# EAGLE design R-breakout (EAGLE 6.6.0)
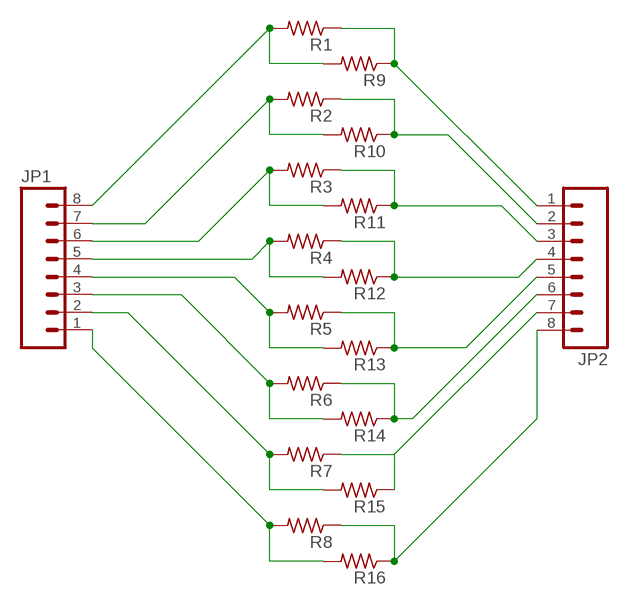
[diagram p0: schematic, sheet 1]

## Parts
JP1  M081X08  [1X08]
JP2  M081X08  [1X08]
R1  RESISTORR0805  [R0805]
R2  RESISTORR0805  [R0805]
R3  RESISTORR0805  [R0805]
R4  RESISTORR0805  [R0805]
R5  RESISTORR0805  [R0805]
R6  RESISTORR0805  [R0805]
R7  RESISTORR0805  [R0805]
R8  RESISTORR0805  [R0805]
R9  RESISTORR1206  [R1206]
R10  RESISTORR1206  [R1206]
R11  RESISTORR1206  [R1206]
R12  RESISTORR1206  [R1206]
R13  RESISTORR1206  [R1206]
R14  RESISTORR1206  [R1206]
R15  RESISTORR1206  [R1206]
R16  RESISTORR1206  [R1206]

## Nets
N$1: JP1.8 R1.2 R9.2
N$2: JP1.7 R2.2 R10.2
N$3: JP1.6 R3.2 R11.2
N$4: JP1.5 R4.2 R12.2
N$5: JP1.4 R5.2 R13.2
N$6: JP1.3 R6.2 R14.2
N$7: JP1.2 R7.2 R15.2
N$8: JP1.1 R8.2 R16.2
N$9: JP2.1 R1.1 R9.1
N$10: JP2.2 R2.1 R10.1
N$11: JP2.3 R3.1 R11.1
N$12: JP2.4 R4.1 R12.1
N$13: JP2.5 R5.1 R13.1
N$14: JP2.6 R6.1 R14.1
N$15: JP2.7 R7.1 R15.1
N$16: JP2.8 R8.1 R16.1

## Library data of the parts
JP1 JP2 = iStivi - Header-Connector:M08: Header 8 Standard 8-pin 0.1" header. Use with straight break away headers (SKU : PRT-00116), right angle break away headers (PRT-00553), swiss pins (PRT-00743), machine pins (PRT-00117), and female headers (PRT-00115).
R1-R16 = iStivi - RCLD:RESISTOR: RESISTOR

## Board
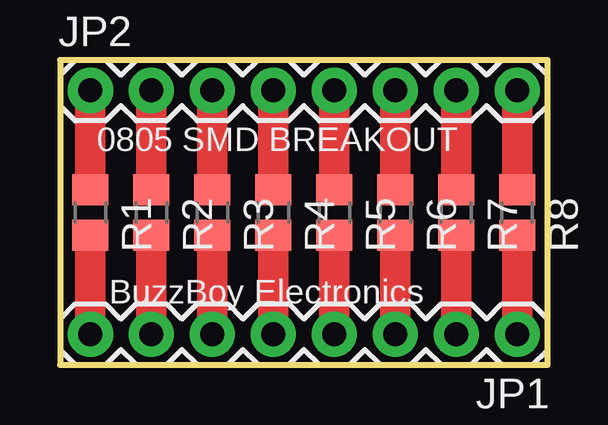
[diagram p1: board, top side]
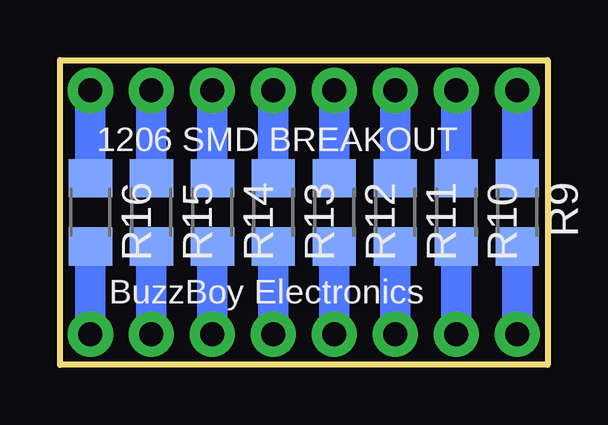
[diagram p2: board, bottom side, seen from below]

Size 20.32 x 12.7 mm. Coordinates in mm from the lower left corner, seen from the top.
Outline: 0,0 20.32,0 20.32,12.7 0,12.7 0,0
Copper layers (1*16): Top 0.035mm / dielectric 1.5mm / Bottom 0.035mm
Design rules "default": minimum track width 10mil, minimum drill 0.6mm, track to track 8mil, track to pad 8mil, pad to pad 8mil, via to via 8mil, smd to smd 8mil, copper to edge 40mil, drill to drill 8mil, minimum pad ring 10mil, minimum via ring 8mil, stop-mask expansion 4mil, vias tented up to drill 0mil, thermal gap 10mil

### Footprints (pad centres in the part's own frame; a part is rotated, then mirrored left to right if it is on the bottom)
1X08 = drill 1 pad 1.88: 1 0,0; 2 2.54,0; 3 5.08,0; 4 7.62,0; 5 10.16,0; 6 12.7,0; 7 15.24,0; 8 17.78,0
R0805 = smd 1.3 x 1.5: 1 -0.95,0; 2 0.95,0
R1206 = smd 1.6 x 1.803: 1 -1.422,0; 2 1.422,0

### Placement (x,y rotation side)
JP1  19.05,1.27 180 top
JP2  1.27,11.43 0 top
R1  1.27,6.35 270 top
R2  3.81,6.35 270 top
R3  6.35,6.35 270 top
R4  8.89,6.35 270 top
R5  11.43,6.35 270 top
R6  13.97,6.35 270 top
R7  16.51,6.35 270 top
R8  19.05,6.35 270 top
R9  1.27,6.35 270 bottom
R10  3.81,6.35 270 bottom
R11  6.35,6.35 270 bottom
R12  8.89,6.35 270 bottom
R13  11.43,6.35 270 bottom
R14  13.97,6.35 270 bottom
R15  16.51,6.35 270 bottom
R16  19.05,6.35 270 bottom

### Tracks (layer width: path | path; a pad name or v marks a point on that pad's centre or on a via)
N$1
  Top 1.27: R1.2 JP1.8
  Bottom 1.27: R9.2 JP1.8
N$2
  Top 1.27: R2.2 JP1.7
  Bottom 1.27: R10.2 JP1.7
N$3
  Top 1.27: R3.2 JP1.6
  Bottom 1.27: R11.2 JP1.6
N$4
  Top 1.27: R4.2 JP1.5
  Bottom 1.27: R12.2 JP1.5
N$5
  Top 1.27: R5.2 JP1.4
  Bottom 1.27: R13.2 JP1.4
N$6
  Top 1.27: R6.2 JP1.3
  Bottom 1.27: R14.2 JP1.3
N$7
  Top 1.27: R7.2 JP1.2
  Bottom 1.27: R15.2 JP1.2
N$8
  Top 1.27: R8.2 JP1.1
  Bottom 1.27: R16.2 JP1.1
N$9
  Top 1.27: R1.1 JP2.1
  Bottom 1.27: R9.1 JP2.1
N$10
  Top 1.27: R2.1 JP2.2
  Bottom 1.27: R10.1 JP2.2
N$11
  Top 1.27: R3.1 JP2.3
  Bottom 1.27: R11.1 JP2.3
N$12
  Top 1.27: R4.1 JP2.4
  Bottom 1.27: R12.1 JP2.4
N$13
  Top 1.27: R5.1 JP2.5
  Bottom 1.27: R13.1 JP2.5
N$14
  Top 1.27: R6.1 JP2.6
  Bottom 1.27: R14.1 JP2.6
N$15
  Top 1.27: R7.1 JP2.7
  Bottom 1.27: R15.1 JP2.7
N$16
  Top 1.27: R8.1 JP2.8
  Bottom 1.27: JP2.8 R16.1

### Text on the board
_tsilk: 0805 SMD BREAKOUT | BuzzBoy Electronics
_bsilk: 1206 SMD BREAKOUT | BuzzBoy Electronics